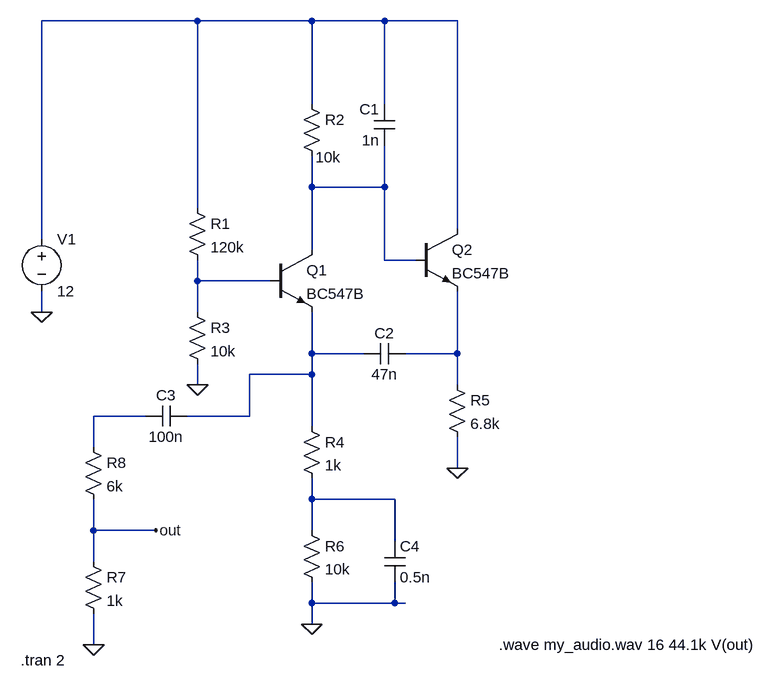
[diagram p0: schematic basic_audio.asc]
basic_audio.asc, the LTspice schematic file:
Version 4
SHEET 1 1160 776
WIRE 176 -224 -64 -224
WIRE 352 -224 176 -224
WIRE 464 -224 352 -224
WIRE 576 -224 464 -224
WIRE 352 -96 352 -224
WIRE 464 -96 464 -224
WIRE 352 32 352 -16
WIRE 464 32 464 -32
WIRE 464 32 352 32
WIRE 176 64 176 -224
WIRE 576 96 576 -224
WIRE -64 112 -64 -224
WIRE 352 128 352 32
WIRE 464 144 464 32
WIRE 512 144 464 144
WIRE 176 176 176 144
WIRE 288 176 176 176
WIRE -64 224 -64 192
WIRE 176 224 176 176
WIRE 352 288 352 224
WIRE 432 288 352 288
WIRE 576 288 576 192
WIRE 576 288 496 288
WIRE 352 320 352 288
WIRE 352 320 256 320
WIRE 176 336 176 304
WIRE 576 336 576 288
WIRE 96 384 16 384
WIRE 256 384 256 320
WIRE 256 384 160 384
WIRE 352 400 352 320
WIRE 16 432 16 384
WIRE 576 464 576 416
WIRE 352 512 352 480
WIRE 480 512 352 512
WIRE 16 560 16 512
WIRE 112 560 16 560
WIRE 352 560 352 512
WIRE 480 576 480 512
WIRE 16 608 16 560
WIRE 352 672 352 640
WIRE 480 672 480 640
WIRE 480 672 352 672
WIRE 496 672 480 672
WIRE 352 704 352 672
WIRE 16 736 16 688
FLAG -64 224 0
FLAG 352 704 0
FLAG 16 736 0
FLAG 576 464 0
FLAG 176 336 0
FLAG 112 560 out
SYMBOL voltage -64 96 R0
WINDOW 123 0 0 Left 0
WINDOW 39 0 0 Left 0
SYMATTR InstName V1
SYMATTR Value 12
SYMBOL res 160 48 R0
SYMATTR InstName R1
SYMATTR Value 120k
SYMBOL res 336 -112 R0
WINDOW 3 22 98 Left 2
SYMATTR Value 10k
SYMATTR InstName R2
SYMBOL res 160 208 R0
SYMATTR InstName R3
SYMATTR Value 10k
SYMBOL npn 288 128 R0
SYMATTR InstName Q1
SYMATTR Value BC547B
SYMBOL npn 512 96 R0
SYMATTR InstName Q2
SYMATTR Value BC547B
SYMBOL res 336 384 R0
SYMATTR InstName R4
SYMATTR Value 1k
SYMBOL res 560 320 R0
SYMATTR InstName R5
SYMATTR Value 6.8k
SYMBOL res 336 544 R0
SYMATTR InstName R6
SYMATTR Value 10k
SYMBOL res 0 592 R0
SYMATTR InstName R7
SYMATTR Value 1k
SYMBOL res 0 416 R0
SYMATTR InstName R8
SYMATTR Value 6k
SYMBOL cap 480 -32 R180
WINDOW 0 24 56 Left 2
WINDOW 3 24 8 Left 2
SYMATTR InstName C1
SYMATTR Value 1n
SYMBOL cap 432 304 R270
WINDOW 0 32 32 VTop 2
WINDOW 3 0 32 VBottom 2
SYMATTR InstName C2
SYMATTR Value 47n
SYMBOL cap 96 400 R270
WINDOW 0 32 32 VTop 2
WINDOW 3 0 32 VBottom 2
SYMATTR InstName C3
SYMATTR Value 100n
SYMBOL cap 464 576 R0
SYMATTR InstName C4
SYMATTR Value 0.5n
TEXT -96 760 Left 2 !.tran 2
TEXT 640 736 Left 2 !.wave my_audio.wav 16 44.1k V(out)

The netlist it stands for:
* basic_audio.asc
V1 N001 0 12
R1 N001 N003 120k
R2 N001 N002 10k
R3 N003 0 10k
Q1 N002 N003 N004 0 BC547B
Q2 N001 N002 N005 0 BC547B
R4 N004 N007 1k
R5 N005 0 6.8k
R6 N007 0 10k
R7 out 0 1k
R8 N006 out 6k
C1 N002 N001 1n
C2 N004 N005 47n
C3 N006 N004 100n
C4 N007 0 0.5n
.model NPN NPN
.model PNP PNP
.lib standard.bjt
.tran 2
.wave my_audio.wav 16 44.1k V(out)
.backanno
.end